# EAGLE design 1107 (EAGLE 7.2.0)
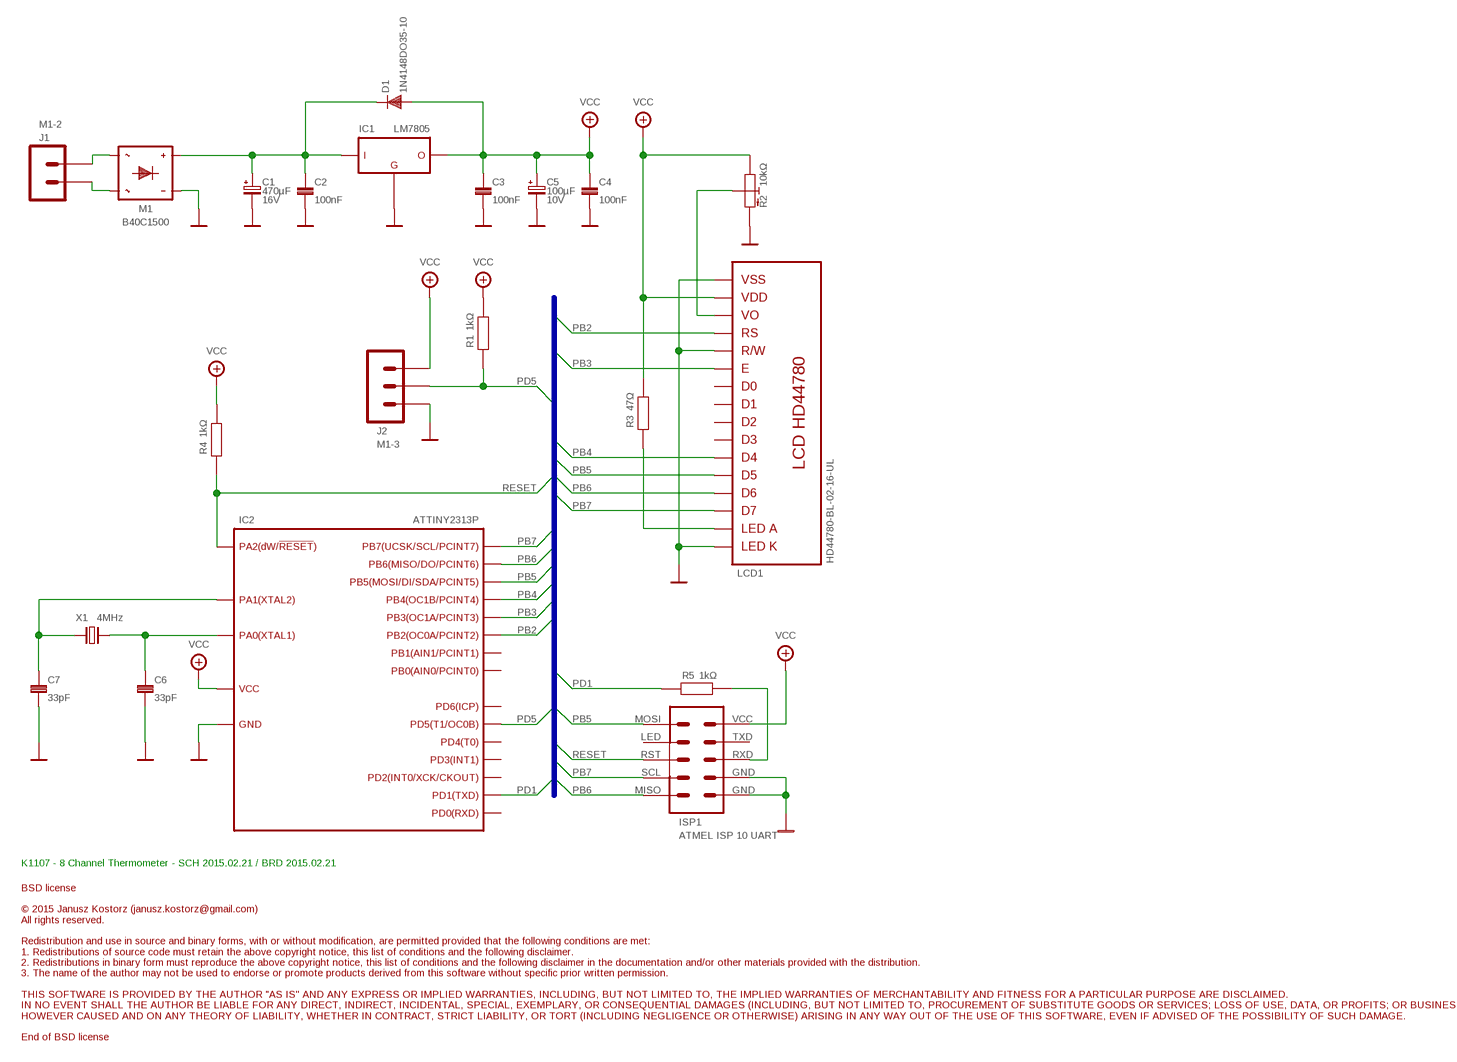
[diagram p0: schematic, sheet 1]

## Parts
C1  470µF  FC1C471L  [E-080-150-035-060]
C2  100nF  CC1206  [C1206]
C3  100nF  CC1206  [C1206]
C4  100nF  CC1206  [C1206]
C5  100µF  FC1A101  [E-050-150-020-050]
C6  33pF  CC1206  [C1206]
C7  33pF  CC1206  [C1206]
D1  1N4148DO35-10  [DO35-10]
IC1  LM7805  LM78XX-C-H  [TO220-H]
IC2  ATTINY2313P  [DIL20]
ISP1  ATMEL ISP 10 UART  ATMEL-ISP-10-UART-V  [MM-10-V]
J1  M1-2  1-2  [1-2]
J2  M1-3  1-3  [1-3]
LCD1  HD44780-BL-02-16-UL  [02-16-UL-BL]
M1  B40C1500  B40C1500R  [RB1A]
R1  1kΩ  RM1206  [M1206]
R2  10kΩ  POTCA6V  [POT_CA6V]
R3  47Ω  RM1206  [M1206]
R4  1kΩ  RM1206  [M1206]
R5  1kΩ  RM1206  [M1206]
X1  4MHz  CRYSTALHC49S  [HC49/S]

## Nets
A [GND]: LCD1.15(A) R3.1
GND: C1.- C2.2 C3.2 C4.2 C5.- C6.2 C7.2 IC1.2(GND) IC2.10(GND) ISP1.8(GND) ISP1.10(GND) J2.3 LCD1.1(VSS) LCD1.5(R/W) LCD1.16(K) M1.- R2.E
N$1: C6.1 IC2.5(PA0) X1.2
N$2: J1.1 M1.AC@2(~)
N$3: C7.1 IC2.4(PA1) X1.1
N$4: C1.+ C2.1 D1.C IC1.1(IN) M1.+
N$5: LCD1.3(VO) R2.S
N$6: J1.2 M1.AC@1(~)
N$8: ISP1.6(RXD) R5.2
PB2: IC2.14(PB2) LCD1.4(RS)
PB3: IC2.15(PB3) LCD1.6(E)
PB4: IC2.16(PB4) LCD1.11(DB4)
PB5: IC2.17(PB5) ISP1.1(MOSI) LCD1.12(DB5)
PB6: IC2.18(PB6) ISP1.9(MISO) LCD1.13(DB6)
PB7: IC2.19(PB7) ISP1.7(SCL) LCD1.14(DB7)
PD1: IC2.3(PD1) R5.1
PD5: IC2.9(PD5) J2.2 R1.1
RESET: IC2.1(PA2) ISP1.5(RST) R4.1
VCC: C3.1 C4.1 C5.+ D1.A IC1.3(OUT) IC2.20(VCC) ISP1.2(VCC) J2.1 LCD1.2(VDD) R1.2 R2.A R3.2 R4.2
Unconnected: IC2.2(PD0) IC2.6(PD2) IC2.7(PD3) IC2.8(PD4) IC2.11(PD6) IC2.12(PB0) IC2.13(PB1) ISP1.3(LED) ISP1.4(TXD) LCD1.7(DB0) LCD1.8(DB1) LCD1.9(DB2) LCD1.10(DB3)

## Buses
BUS:RESET,PB[0..7],PD[0..6]

## Notes on the sheet
- K1107 - 8 Channel Thermometer - SCH 2015.02.21 / BRD 2015.02.21

## Library data of the parts
C1 = capacitors-panasonic-fc-a:FC1C471: 470µF / 16V; VOLTAGE: 16V
C2-C4 C6 C7 = rcl:C
C5 = capacitors-panasonic-fc-a:FC1A101: 100µF / 10V; VOLTAGE: 10V
D1 = diodes:1N4148: DIODE high speed (Philips)
IC1 = vreg:LM78XX
IC2 = ic-atmel:ATTINY2313
ISP1 = con-isp:ATMEL-ISP-10-UART
J1 = con-pins:1-2
J2 = con-pins:1-3
LCD1 = lcd:HD44780-BL
M1 = rectifiers:B40C1500R
R1 R3-R5 = rcl:R
R2 = rcl:POT
X1 = crystal:CRYSTAL

## Board
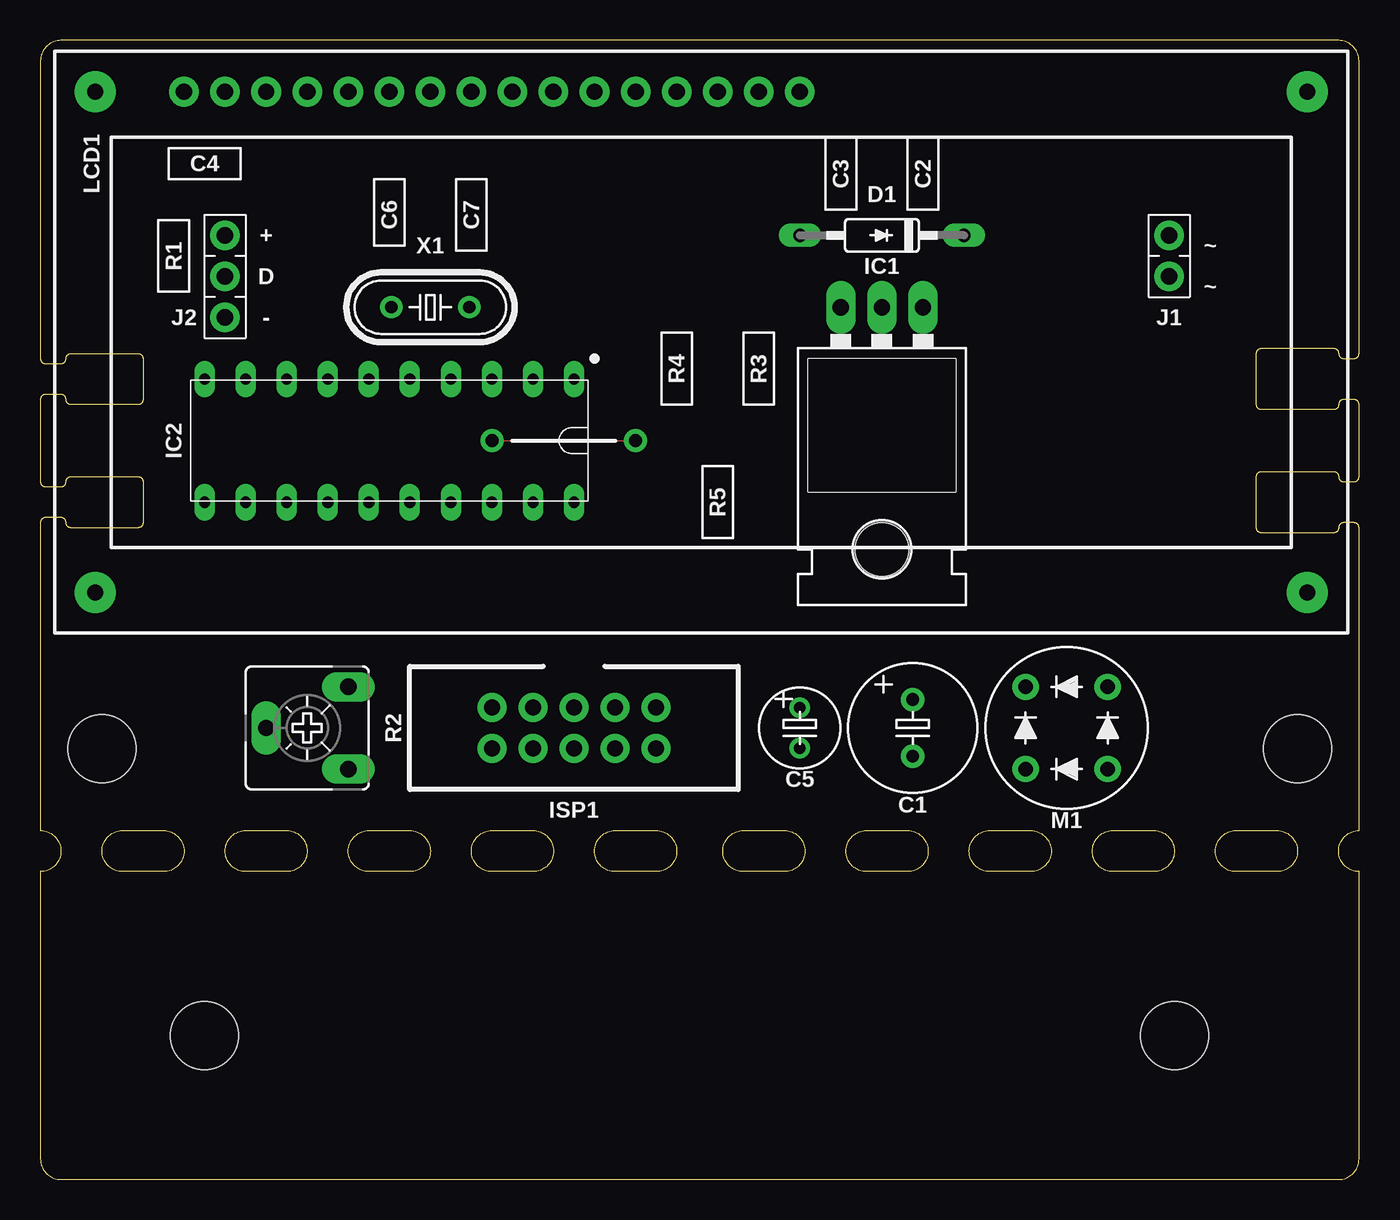
[diagram p1: board, top side]
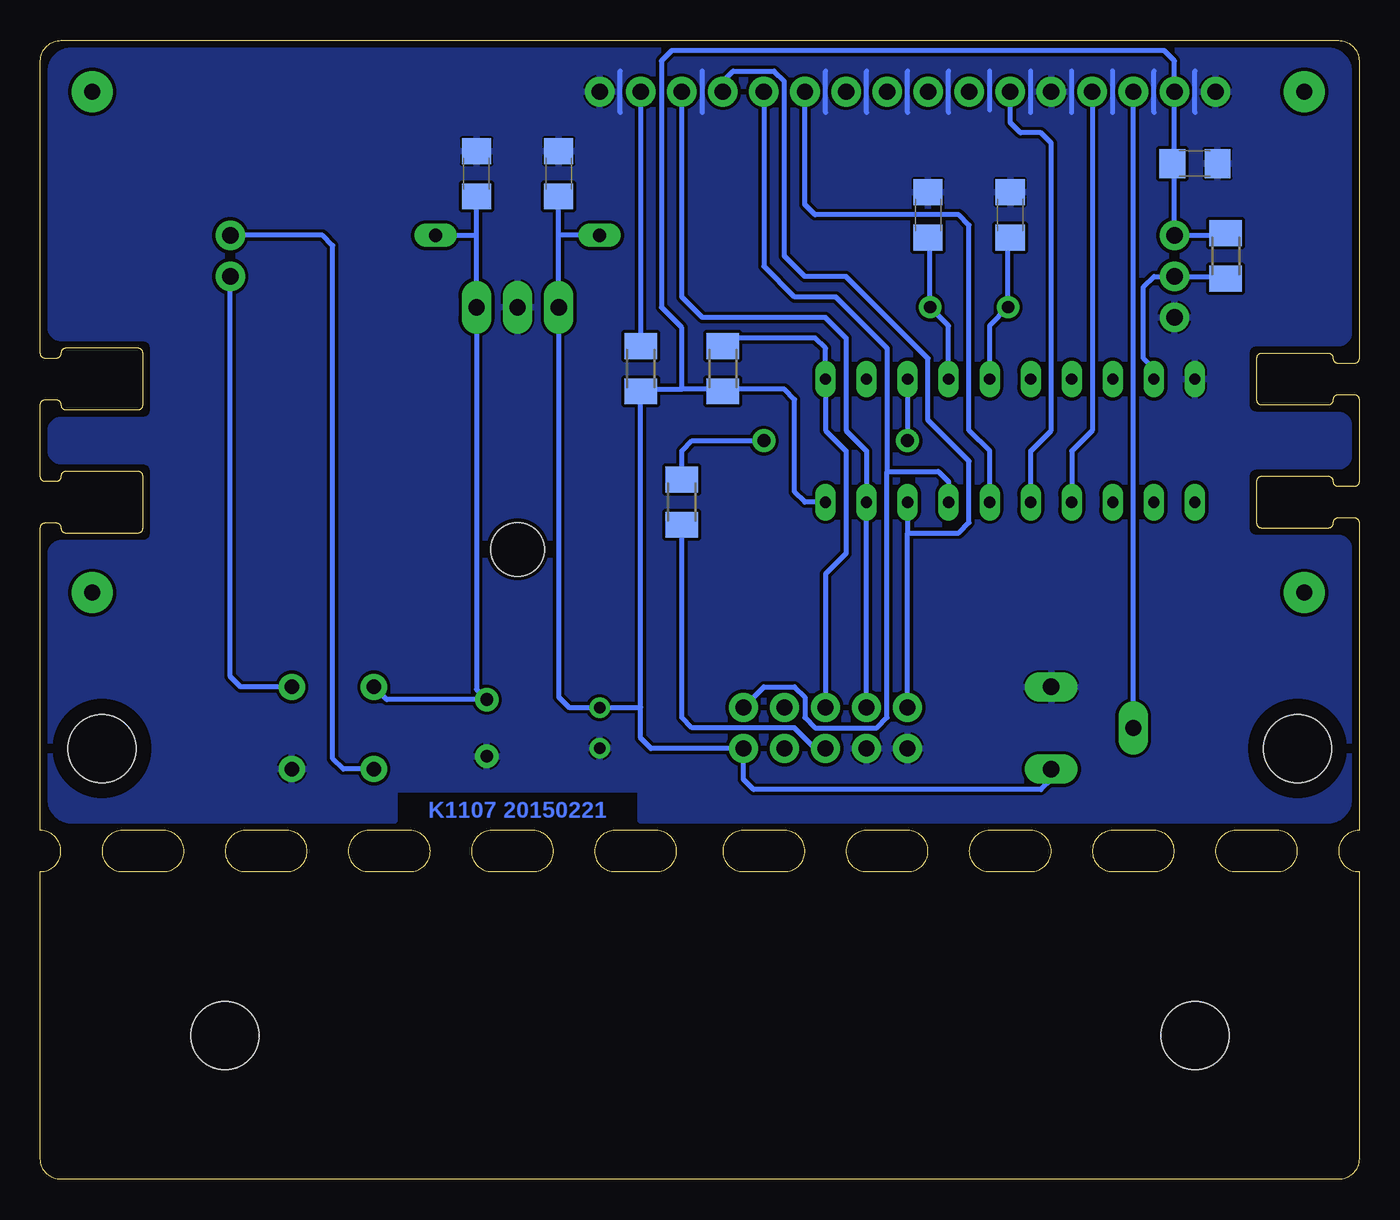
[diagram p2: board, bottom side, seen from below]

Size 81.6 x 70.48 mm. Coordinates in mm from the lower left corner, seen from the top.
Outline: 1.27,0 80.33,0 arc90 81.6,1.27 81.6,19.05 arc-90 80.33,20.32 arc-90 81.6,21.59 81.6,40.32 arc90 81.28,40.64 80.64,40.64 arc90 80.33,40.32 arc-90 80.01,40.01 75.56,40.01 arc-90 75.25,40.32 75.25,43.5 arc-90 75.56,43.81 80.01,43.81 arc-90 80.33,43.5 arc90 80.64,43.18 81.28,43.18 arc90 81.6,43.5 81.6,47.94 arc90 81.28,48.26 80.64,48.26 arc90 80.33,47.94 arc-90 80.01,47.62 75.56,47.62 arc-90 75.25,47.94 75.25,51.12 arc-90 75.56,51.44 80.01,51.44 arc-90 80.33,51.12 arc90 80.64,50.8 81.28,50.8 arc90 81.6,51.12 81.6,69.22 arc90 80.33,70.48 1.27,70.48 arc90 0,69.22 0,50.8 arc90 0.32,50.48 1.27,50.48 arc90 1.59,50.8 arc-90 1.91,51.12 6.03,51.12 arc-90 6.35,50.8 6.35,48.26 arc-90 6.03,47.94 1.91,47.94 arc-90 1.59,48.26 arc90 1.27,48.58 0.32,48.58 arc90 0,48.26 0,43.18 arc90 0.32,42.86 1.27,42.86 arc90 1.59,43.18 arc-90 1.91,43.5 6.03,43.5 arc-90 6.35,43.18 6.35,40.64 arc-90 6.03,40.32 1.91,40.32 arc-90 1.59,40.64 arc90 1.27,40.96 0.32,40.96 arc90 0,40.64 0,21.59 arc-90 1.27,20.32 arc-90 0,19.05 0,1.27 arc90 1.27,0
Outline: 5.08,21.59 7.62,21.59 arc-90 8.89,20.32 arc-90 7.62,19.05 5.08,19.05 arc-90 3.81,20.32 arc-90 5.08,21.59
Outline: 12.7,21.59 15.24,21.59 arc-90 16.51,20.32 arc-90 15.24,19.05 12.7,19.05 arc-90 11.43,20.32 arc-90 12.7,21.59
Outline: 73.98,21.59 76.52,21.59 arc-90 77.79,20.32 arc-90 76.52,19.05 73.98,19.05 arc-90 72.71,20.32 arc-90 73.98,21.59
Outline: 66.36,21.59 68.9,21.59 arc-90 70.17,20.32 arc-90 68.9,19.05 66.36,19.05 arc-90 65.09,20.32 arc-90 66.36,21.59
Outline: 58.74,21.59 61.28,21.59 arc-90 62.55,20.32 arc-90 61.28,19.05 58.74,19.05 arc-90 57.47,20.32 arc-90 58.74,21.59
Outline: 20.32,21.59 22.86,21.59 arc-90 24.13,20.32 arc-90 22.86,19.05 20.32,19.05 arc-90 19.05,20.32 arc-90 20.32,21.59
Outline: 27.94,21.59 30.48,21.59 arc-90 31.75,20.32 arc-90 30.48,19.05 27.94,19.05 arc-90 26.67,20.32 arc-90 27.94,21.59
Outline: 51.12,21.59 53.66,21.59 arc-90 54.93,20.32 arc-90 53.66,19.05 51.12,19.05 arc-90 49.85,20.32 arc-90 51.12,21.59
Outline: 43.5,21.59 46.04,21.59 arc-90 47.31,20.32 arc-90 46.04,19.05 43.5,19.05 arc-90 42.23,20.32 arc-90 43.5,21.59
Outline: 35.56,21.59 38.1,21.59 arc-90 39.37,20.32 arc-90 38.1,19.05 35.56,19.05 arc-90 34.29,20.32 arc-90 35.56,21.59
Copper layers (1*16): Top 0.035mm / dielectric 1.5mm / Bottom 0.035mm
Design rules "manualmount": minimum track width 10mil, minimum drill 0.3mm, track to track 8mil, track to pad 8mil, pad to pad 8mil, via to via 8mil, smd to smd 8mil, copper to edge 10mil, drill to drill 8mil, minimum pad ring 10mil, minimum via ring 8mil, stop-mask expansion 5mil, vias tented up to drill 0mil, thermal gap 5mil
Holes 4.2 mm at 3.81,26.67 77.79,26.67 10.16,8.89 70.17,8.89
bRestrict: area 75.2,24.1 to 80.3,29.2; area 1.3,24.1 to 6.3,29.2

### Footprints (pad centres in the part's own frame; a part is rotated, then mirrored left to right if it is on the bottom)
E-080-150-035-060 = drill 0.8: + -1.75,0; - 1.75,0
C1206 = smd 1.6 x 1.8: 1 -1.4,0; 2 1.4,0
E-050-150-020-050 = drill 0.7: + -1.25,0; - 1.25,0
DO35-10 = drill 0.813 long: A 5.08,0; C -5.08,0
TO220-H = drill 1.016 long: 1 -2.54,-3.81; 2 0,-3.81; 3 2.54,-3.81 | hole 3.302: 0,11.176
DIL20 = drill 0.7 long: 1 -3.81,11.43; 2 -3.81,8.89; 3 -3.81,6.35; 4 -3.81,3.81; 5 -3.81,1.27; 6 -3.81,-1.27; 7 -3.81,-3.81; 8 -3.81,-6.35; 9 -3.81,-8.89; 10 -3.81,-11.43; 11 3.81,-11.43; 12 3.81,-8.89; 13 3.81,-6.35; 14 3.81,-3.81; 15 3.81,-1.27; 16 3.81,1.27; 17 3.81,3.81; 18 3.81,6.35; 19 3.81,8.89; 20 3.81,11.43
MM-10-V = drill 1: 1 -5.08,-1.27; 2 -5.08,1.27; 3 -2.54,-1.27; 4 -2.54,1.27; 5 0,-1.27; 6 0,1.27; 7 2.54,-1.27; 8 2.54,1.27; 9 5.08,-1.27; 10 5.08,1.27
1-2 = drill 1.016: 1 0,0; 2 2.54,0
1-3 = drill 1.016: 1 0,0; 2 2.54,0; 3 5.08,0
02-16-UL-BL = drill 1.016: 1 0,0; 2 2.54,0; 3 5.08,0; 4 7.62,0; 5 10.16,0; 6 12.7,0; 7 15.24,0; 8 17.78,0; 9 20.32,0; 10 22.86,0; 11 25.4,0; 12 27.94,0; 13 30.48,0; 14 33.02,0; 15 35.56,0; 16 38.1,0 | drill 1 pad 2.54: MLD -5.5,-31; MLU -5.5,0; MRD 69.5,-31; MRU 69.5,0
RB1A = drill 0.9: + -2.54,2.54; - 2.54,-2.54; AC@1 2.54,2.54; AC@2 -2.54,-2.54
M1206 = smd 1.6 x 2: 1 -1.4,0; 2 1.4,0
POT_CA6V = drill 1.016 long: A -2.54,-2.54; E 2.54,-2.54; S 0,2.54
HC49/S = drill 0.762: 1 -2.413,0; 2 2.413,0

### Placement (x,y rotation side)
C1  53.98,27.94 270 top
C2  54.61,62.23 90 bottom
C3  49.53,62.23 90 bottom
C4  10.16,62.87 0 bottom
C5  46.99,27.94 270 top
C6  21.59,59.69 90 bottom
C7  26.67,59.69 90 bottom
D1  52.07,58.42 180 top
IC1  52.07,50.16 180 top
IC2  21.59,45.72 270 top
ISP1  33.02,27.94 180 top
J1  69.85,58.42 270 top
J2  11.43,58.42 270 top
LCD1  8.89,67.31 0 top
M1  63.5,27.94 0 top
R1  8.26,57.15 90 bottom
R2  16.51,27.94 90 top
R3  44.45,50.16 270 bottom
R4  39.37,50.16 270 bottom
R5  41.91,41.91 270 bottom
X1  24.13,53.98 180 top

### Tracks (layer width: path | path; a pad name or v marks a point on that pad's centre or on a via)
A
  Bottom 0.305: LCD1.15 R3.1
GND
  Bottom 0.305: 12.7,66.04 12.7,68.58 | 22.86,66.17 22.86,68.58 | 15.24,66.04 15.24,68.58 | 17.78,66.04 17.78,68.58 | 20.32,66.04 20.32,68.58 | 25.4,66.04 25.4,68.58 | 27.94,66.04 27.94,68.58 | 40.64,66.04 40.64,68.58 | 45.72,66.04 45.72,68.58 | 10.16,66.04 10.16,68.58 | 30.48,66.04 30.48,68.58 | 33.02,66.04 33.02,68.58
  pour Bottom: 1.91,69.85 79.69,69.85 arc-90 80.96,68.58 80.96,52.7 arc-90 80.33,52.07 75.25,52.07 arc90 74.61,51.44 74.61,47.62 arc90 75.25,46.99 80.33,46.99 arc-90 80.96,46.35 80.96,45.09 arc-90 80.33,44.45 75.25,44.45 arc90 74.61,43.81 74.61,40.01 arc90 75.25,39.37 80.33,39.37 arc-90 80.96,38.73 80.96,23.5 arc-90 79.69,22.23 59.69,22.23 59.69,24.13 44.45,24.13 44.45,22.23 1.91,22.23 arc-90 0.64,23.5 0.64,39.05 arc-90 1.27,39.69 6.35,39.69 arc90 6.99,40.32 6.99,43.5 arc90 6.35,44.13 1.27,44.13 arc-90 0.64,44.77 0.64,46.67 arc-90 1.27,47.31 6.35,47.31 arc90 6.99,47.94 6.99,51.12 arc90 6.35,51.75 1.27,51.75 arc-90 0.64,52.39 0.64,68.58 arc-90
N$1
  Bottom 0.305: IC2.5 22.86,52.83 X1.2 21.72,58.16 C6.1
N$2
  Bottom 0.305: M1.AC@2 62.87,25.4 63.5,26.04 63.5,57.78 64.14,58.42 J1.1
N$3
  Bottom 0.305: IC2.4 25.4,52.83 X1.1 26.54,58.16 C7.1
N$4
  Bottom 0.305: 54.61,58.42 IC1.1 54.61,30.32 C1.+ 60.17,29.69 M1.+ | 54.61,58.42 C2.1 | D1.C 54.61,58.42
N$5
  Bottom 0.305: R2.S LCD1.3
N$6
  Bottom 0.305: M1.AC@1 69.22,30.48 69.85,31.11 J1.2
N$8
  Bottom 0.305: ISP1.6 33.66,26.67 34.92,27.94 41.27,27.94 41.91,28.57 R5.2
PB2
  Bottom 0.305: LCD1.4 16.51,46.35 17.78,45.09 IC2.14
PB3
  Bottom 0.305: IC2.15 20.32,45.09 19.05,46.35 19.05,64.14 19.68,64.77 20.95,64.77 21.59,65.41 LCD1.6
PB4
  Bottom 0.305: IC2.16 22.86,45.09 24.13,46.35 24.13,59.05 24.77,59.69 33.66,59.69 34.29,60.33 LCD1.11
PB5
  Bottom 0.305: ISP1.1 36.83,30.48 34.92,30.48 34.29,29.84 34.29,28.57 33.66,27.94 29.84,27.94 29.21,28.57 29.21,43.81 | 29.21,43.81 26.04,43.81 25.4,43.18 IC2.17 | LCD1.12 36.83,56.52 34.92,54.61 32.38,54.61 29.21,51.44 29.21,43.81
PB6
  Bottom 0.305: LCD1.13 39.37,67.94 38.73,68.58 36.2,68.58 35.56,67.94 35.56,57.15 34.29,55.88 31.75,55.88 26.67,50.8 26.67,46.99 24.13,44.45 24.13,40.64 24.77,40.01 27.94,40.01 | IC2.18 27.94,40.01 | ISP1.9 27.94,40.01
PB7
  Bottom 0.305: ISP1.7 IC2.19 30.48,45.09 31.75,46.35 31.75,52.07 33.02,53.34 40.64,53.34 41.91,54.61 LCD1.14
PD1  (via drill 0.8 pad 1.42)
  Top 0: v27.94,45.72 v36.83,45.72
  Bottom 0.305: R5.1 41.91,45.09 41.27,45.72 v36.83,45.72 | IC2.3 v27.94,45.72
PD5
  Bottom 0.305: R1.1 8.38,55.88 J2.2 12.7,55.88 13.34,55.24 13.34,50.8 12.7,50.16 IC2.9
RESET
  Bottom 0.305: ISP1.5 33.02,37.47 31.75,38.73 31.75,45.09 33.02,46.35 IC2.1 33.02,51.44 33.66,52.07 38.87,52.07 R4.1
VCC
  Bottom 0.305: 44.45,29.21 44.45,27.3 43.81,26.67 ISP1.2 38.1,24.77 37.47,24.13 19.68,24.13 19.05,24.77 R2.A | 44.45,29.21 R3.2 44.58,48.9 41.91,48.9 | 41.91,48.9 41.91,52.7 43.18,53.98 43.18,69.22 42.55,69.85 12.06,69.85 11.43,69.22 LCD1.2 11.43,62.87 | IC2.20 34.29,41.91 34.92,42.55 34.92,48.26 35.56,48.9 39.37,48.9 | 39.37,48.9 41.91,48.9 | R4.2 39.37,48.9 | R1.2 8.38,58.42 J2.1 11.43,62.87 | C4.1 11.43,62.87 | 49.53,58.42 IC1.3 49.53,29.84 48.9,29.21 47.01,29.21 C5.+ 46.99,29.21 44.45,29.21 | 49.53,58.42 C3.1 | D1.A 49.53,58.42

### Text on the board
Bottom: K1107 20150221
tNames: + | ~ | D | ~ | -
bStop: K1107 20150221